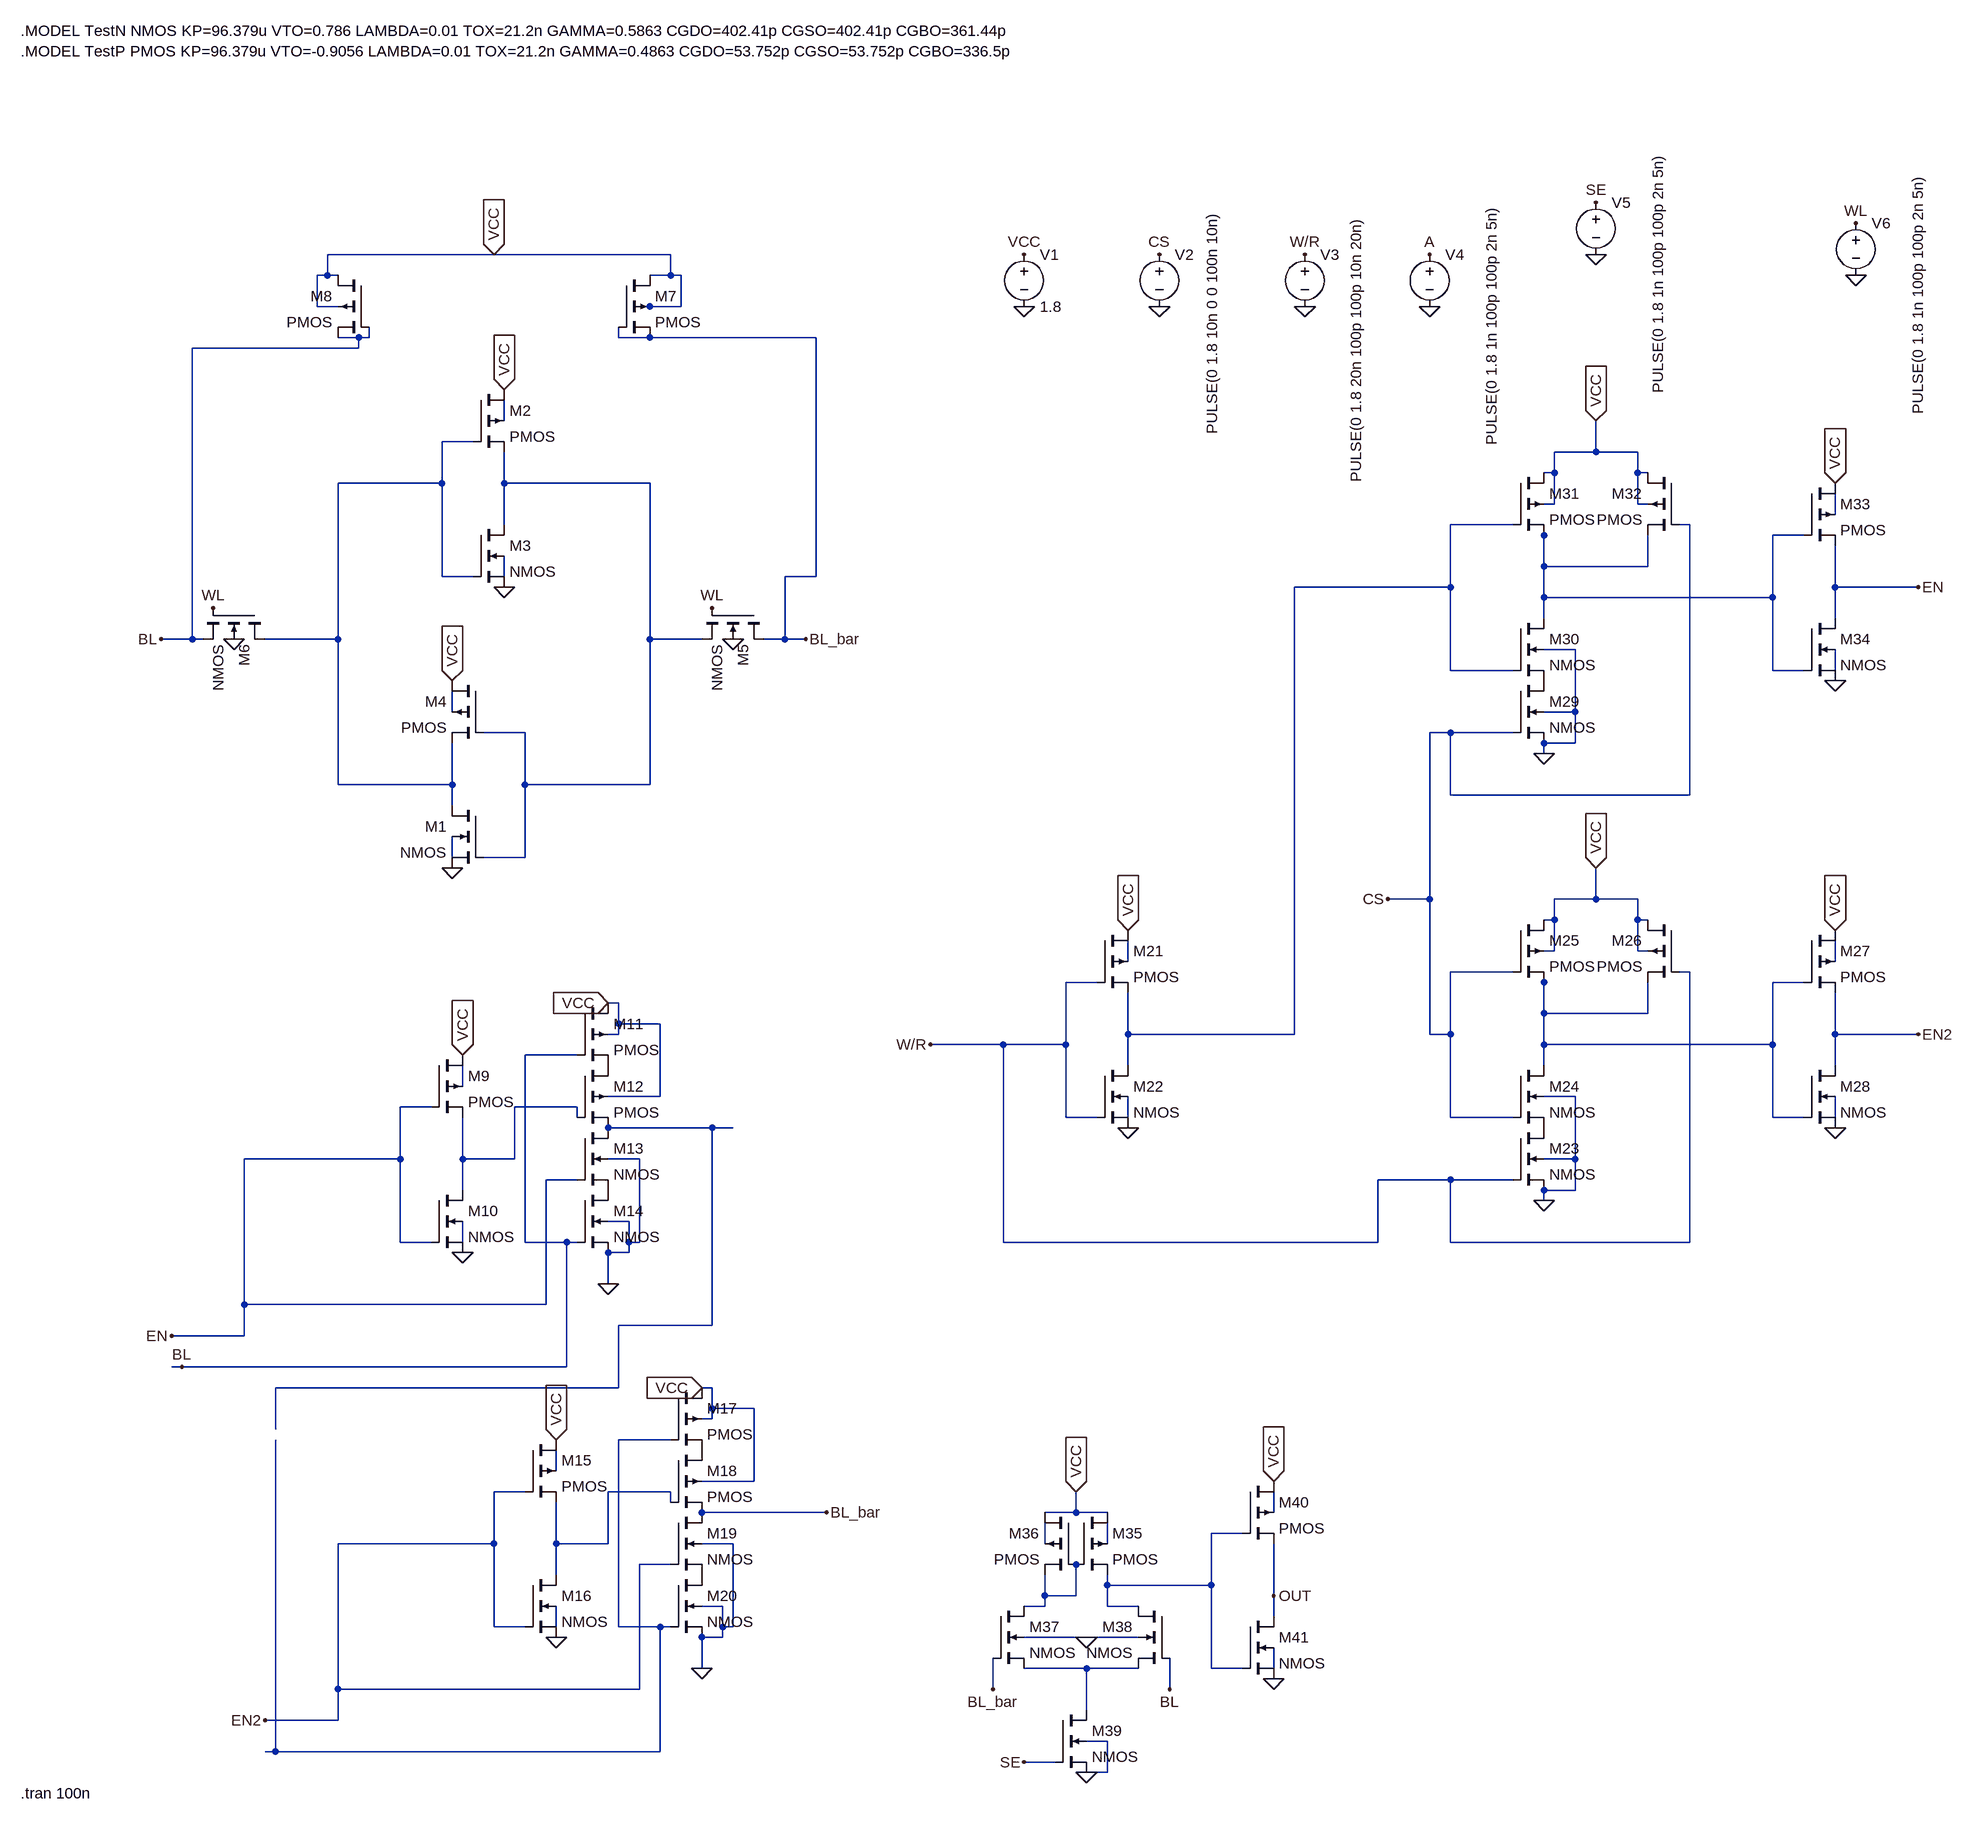
[diagram p0: schematic SirsnoteRAM only ideal.asc]
SirsnoteRAM only ideal.asc, the LTspice schematic file:
Version 4
SHEET 1 2480 2656
WIRE 112 208 -144 208
WIRE 384 208 112 208
WIRE -144 240 -144 208
WIRE -144 240 -160 240
WIRE -128 240 -144 240
WIRE 384 240 384 208
WIRE 384 240 352 240
WIRE 400 240 384 240
WIRE -160 288 -160 240
WIRE -128 288 -160 288
WIRE 352 288 336 288
WIRE 400 288 400 240
WIRE 400 288 352 288
WIRE -96 336 -128 336
WIRE -80 336 -80 320
WIRE -80 336 -96 336
WIRE 304 336 304 320
WIRE 352 336 304 336
WIRE 608 336 352 336
WIRE -96 352 -96 336
WIRE -96 352 -352 352
WIRE 128 464 128 432
WIRE 80 496 32 496
WIRE 1808 512 1808 464
WIRE 1808 512 1744 512
WIRE 1872 512 1808 512
WIRE 1744 544 1744 512
WIRE 1744 544 1728 544
WIRE 1872 544 1872 512
WIRE 1888 544 1872 544
WIRE 32 560 32 496
WIRE 32 560 -128 560
WIRE 128 560 128 512
WIRE 352 560 128 560
WIRE 1744 592 1744 544
WIRE 1744 592 1728 592
WIRE 1872 592 1872 544
WIRE 1888 592 1872 592
WIRE 2176 608 2176 576
WIRE 128 624 128 560
WIRE 1680 624 1584 624
WIRE 1952 624 1936 624
WIRE 1728 640 1728 624
WIRE 2128 640 2080 640
WIRE 1728 688 1728 640
WIRE 1888 688 1888 640
WIRE 1888 688 1728 688
WIRE 32 704 32 560
WIRE 80 704 32 704
WIRE 128 704 128 672
WIRE 608 704 608 336
WIRE 608 704 560 704
WIRE 1584 720 1584 624
WIRE 1584 720 1344 720
WIRE 2176 720 2176 656
WIRE 2304 720 2176 720
WIRE 1728 736 1728 688
WIRE 2080 736 2080 640
WIRE 2080 736 1728 736
WIRE 1728 768 1728 736
WIRE 2176 768 2176 720
WIRE -352 800 -352 352
WIRE -352 800 -400 800
WIRE -336 800 -352 800
WIRE -128 800 -128 560
WIRE -128 800 -240 800
WIRE 352 800 352 560
WIRE 432 800 352 800
WIRE 560 800 560 704
WIRE 560 800 528 800
WIRE 592 800 560 800
WIRE 1776 816 1728 816
WIRE 1584 848 1584 720
WIRE 1680 848 1584 848
WIRE 2080 848 2080 736
WIRE 2128 848 2080 848
WIRE 2176 848 2176 816
WIRE 48 912 48 880
WIRE 1776 912 1776 816
WIRE 1776 912 1728 912
WIRE 160 944 96 944
WIRE 1584 944 1552 944
WIRE 1680 944 1584 944
WIRE 1776 960 1776 912
WIRE 1776 960 1728 960
WIRE 1728 976 1728 960
WIRE -128 1024 -128 800
WIRE 48 1024 48 960
WIRE 48 1024 -128 1024
WIRE 160 1024 160 944
WIRE 352 1024 352 800
WIRE 352 1024 160 1024
WIRE 1584 1040 1584 944
WIRE 1952 1040 1952 624
WIRE 1952 1040 1584 1040
WIRE 48 1056 48 1024
WIRE 48 1136 48 1104
WIRE 160 1136 160 1024
WIRE 160 1136 96 1136
WIRE 1552 1200 1552 944
WIRE 1552 1200 1488 1200
WIRE 1808 1200 1808 1152
WIRE 1808 1200 1744 1200
WIRE 1872 1200 1808 1200
WIRE 1744 1232 1744 1200
WIRE 1744 1232 1728 1232
WIRE 1872 1232 1872 1200
WIRE 1888 1232 1872 1232
WIRE 1744 1280 1744 1232
WIRE 1744 1280 1728 1280
WIRE 1872 1280 1872 1232
WIRE 1888 1280 1872 1280
WIRE 1088 1296 1088 1264
WIRE 2176 1296 2176 1264
WIRE 1680 1312 1584 1312
WIRE 1952 1312 1936 1312
WIRE 1040 1328 992 1328
WIRE 1728 1328 1728 1312
WIRE 2128 1328 2080 1328
WIRE 304 1360 288 1360
WIRE 1728 1376 1728 1328
WIRE 1888 1376 1888 1328
WIRE 1888 1376 1728 1376
WIRE 304 1392 304 1360
WIRE 368 1392 304 1392
WIRE 304 1408 304 1392
WIRE 304 1408 288 1408
WIRE 1088 1408 1088 1344
WIRE 1344 1408 1344 720
WIRE 1344 1408 1088 1408
WIRE 1552 1408 1552 1200
WIRE 1584 1408 1584 1312
WIRE 1584 1408 1552 1408
WIRE 2176 1408 2176 1344
WIRE 2304 1408 2176 1408
WIRE 896 1424 784 1424
WIRE 992 1424 992 1328
WIRE 992 1424 896 1424
WIRE 1728 1424 1728 1376
WIRE 2080 1424 2080 1328
WIRE 2080 1424 1728 1424
WIRE 240 1440 160 1440
WIRE 1088 1456 1088 1408
WIRE 1728 1456 1728 1424
WIRE 2176 1456 2176 1408
WIRE 64 1488 64 1456
WIRE 368 1504 368 1392
WIRE 368 1504 288 1504
WIRE 1776 1504 1728 1504
WIRE 16 1520 -32 1520
WIRE 240 1520 144 1520
WIRE 240 1536 240 1520
WIRE 992 1536 992 1424
WIRE 1040 1536 992 1536
WIRE 1088 1536 1088 1504
WIRE 1584 1536 1584 1408
WIRE 1680 1536 1584 1536
WIRE 2080 1536 2080 1424
WIRE 2128 1536 2080 1536
WIRE 2176 1536 2176 1504
WIRE 448 1552 288 1552
WIRE 480 1552 448 1552
WIRE -32 1600 -32 1520
WIRE -32 1600 -272 1600
WIRE 64 1600 64 1536
WIRE 144 1600 144 1520
WIRE 144 1600 64 1600
WIRE 336 1600 288 1600
WIRE 1776 1600 1776 1504
WIRE 1776 1600 1728 1600
WIRE 240 1632 192 1632
WIRE 1584 1632 1472 1632
WIRE 1680 1632 1584 1632
WIRE 64 1648 64 1600
WIRE 1776 1648 1776 1600
WIRE 1776 1648 1728 1648
WIRE 1728 1664 1728 1648
WIRE 320 1696 288 1696
WIRE -32 1728 -32 1600
WIRE 16 1728 -32 1728
WIRE 64 1728 64 1696
WIRE 160 1728 160 1440
WIRE 224 1728 160 1728
WIRE 240 1728 224 1728
WIRE 320 1728 320 1696
WIRE 336 1728 336 1600
WIRE 336 1728 320 1728
WIRE 896 1728 896 1424
WIRE 1472 1728 1472 1632
WIRE 1472 1728 896 1728
WIRE 1584 1728 1584 1632
WIRE 1952 1728 1952 1312
WIRE 1952 1728 1584 1728
WIRE 320 1744 320 1728
WIRE 320 1744 288 1744
WIRE 288 1792 288 1744
WIRE -272 1824 -272 1600
WIRE 192 1824 192 1632
WIRE 192 1824 -272 1824
WIRE 448 1856 448 1552
WIRE 448 1856 304 1856
WIRE -272 1872 -272 1824
WIRE -272 1872 -384 1872
WIRE -368 1920 -384 1920
WIRE 224 1920 224 1728
WIRE 224 1920 -368 1920
WIRE 304 1952 304 1856
WIRE 304 1952 -224 1952
WIRE 448 1952 432 1952
WIRE 448 1984 448 1952
WIRE 512 1984 448 1984
WIRE 448 2000 448 1984
WIRE 448 2000 432 2000
WIRE -224 2016 -224 1952
WIRE 384 2032 304 2032
WIRE 208 2080 208 2048
WIRE 512 2096 512 1984
WIRE 512 2096 432 2096
WIRE 160 2112 112 2112
WIRE 384 2112 288 2112
WIRE 384 2128 384 2112
WIRE 624 2144 432 2144
WIRE 1008 2144 1008 2112
WIRE 1008 2144 960 2144
WIRE 1056 2144 1008 2144
WIRE 1312 2144 1312 2112
WIRE 1264 2176 1216 2176
WIRE 112 2192 112 2112
WIRE 112 2192 -128 2192
WIRE 208 2192 208 2128
WIRE 288 2192 288 2112
WIRE 288 2192 208 2192
WIRE 480 2192 432 2192
WIRE 960 2192 960 2160
WIRE 1056 2192 1056 2160
WIRE 384 2224 336 2224
WIRE 208 2240 208 2192
WIRE 1056 2256 1056 2240
WIRE 1216 2256 1216 2176
WIRE 1216 2256 1056 2256
WIRE 960 2272 960 2240
WIRE 1008 2272 1008 2224
WIRE 1008 2272 960 2272
WIRE 1312 2272 1312 2192
WIRE 464 2288 432 2288
WIRE 960 2288 960 2272
WIRE 960 2288 928 2288
WIRE 1056 2288 1056 2256
WIRE 1104 2288 1056 2288
WIRE 1312 2304 1312 2272
WIRE 112 2320 112 2192
WIRE 160 2320 112 2320
WIRE 208 2320 208 2288
WIRE 304 2320 304 2032
WIRE 368 2320 304 2320
WIRE 384 2320 368 2320
WIRE 464 2320 464 2288
WIRE 480 2320 480 2192
WIRE 480 2320 464 2320
WIRE 464 2336 464 2320
WIRE 464 2336 432 2336
WIRE 1024 2336 928 2336
WIRE 1104 2336 1024 2336
WIRE 432 2384 432 2336
WIRE 1024 2384 928 2384
WIRE 1104 2384 1024 2384
WIRE 1216 2384 1216 2256
WIRE 1264 2384 1216 2384
WIRE 1312 2384 1312 2352
WIRE -128 2416 -128 2192
WIRE 336 2416 336 2224
WIRE 336 2416 -128 2416
WIRE 880 2416 880 2368
WIRE 1152 2416 1152 2368
WIRE 1024 2448 1024 2384
WIRE -128 2464 -128 2416
WIRE -128 2464 -240 2464
WIRE 1056 2496 1024 2496
WIRE -224 2512 -224 2032
WIRE -224 2512 -240 2512
WIRE 368 2512 368 2320
WIRE 368 2512 -224 2512
WIRE 976 2528 928 2528
WIRE 1056 2544 1056 2496
WIRE 1056 2544 1024 2544
FLAG -400 800 BL
FLAG 592 800 BL_bar
FLAG 448 752 WL
FLAG -320 752 WL
FLAG 48 864 VCC
IOPIN 48 864 In
FLAG 128 416 VCC
IOPIN 128 416 In
FLAG 48 1152 0
FLAG 128 720 0
FLAG 112 208 VCC
IOPIN 112 208 In
FLAG 64 1440 VCC
IOPIN 64 1440 In
FLAG 64 1744 0
FLAG 288 1360 VCC
IOPIN 288 1360 In
FLAG 288 1792 0
FLAG -384 1872 EN
FLAG 208 2032 VCC
IOPIN 208 2032 In
FLAG 208 2336 0
FLAG 432 1952 VCC
IOPIN 432 1952 In
FLAG 432 2384 0
FLAG 624 2144 BL_bar
FLAG -240 2464 EN2
FLAG -368 1920 BL
FLAG 1088 1248 VCC
IOPIN 1088 1248 In
FLAG 1088 1552 0
FLAG 784 1424 W/R
FLAG 2176 1248 VCC
IOPIN 2176 1248 In
FLAG 2176 1552 0
FLAG 1808 1152 VCC
IOPIN 1808 1152 In
FLAG 1728 1664 0
FLAG 2176 560 VCC
IOPIN 2176 560 In
FLAG 2176 864 0
FLAG 1808 464 VCC
IOPIN 1808 464 In
FLAG 1728 976 0
FLAG 1488 1200 CS
FLAG 2304 1408 EN2
FLAG 2304 720 EN
FLAG 928 288 0
FLAG 1136 288 0
FLAG 1360 288 0
FLAG 1552 288 0
FLAG 928 208 VCC
FLAG 1552 208 A
FLAG 1136 208 CS
FLAG 1360 208 W/R
FLAG -288 800 0
FLAG 480 800 0
FLAG 1008 2112 VCC
IOPIN 1008 2112 In
FLAG 1024 2544 0
FLAG 1024 2336 0
FLAG 1152 2416 BL
FLAG 880 2416 BL_bar
FLAG 928 2528 SE
FLAG 1312 2096 VCC
IOPIN 1312 2096 In
FLAG 1312 2400 0
FLAG 1312 2272 OUT
FLAG 1808 208 0
FLAG 1808 128 SE
FLAG 2208 240 0
FLAG 2208 160 WL
SYMBOL nmos4 96 1056 M0
SYMATTR InstName M1
SYMBOL pmos4 80 416 R0
SYMATTR InstName M2
SYMBOL nmos4 80 624 R0
SYMATTR InstName M3
SYMBOL pmos4 96 864 M0
SYMATTR InstName M4
SYMBOL nmos4 528 752 R90
SYMATTR InstName M5
SYMBOL nmos4 -240 752 R90
SYMATTR InstName M6
SYMBOL pmos4 304 240 R0
SYMATTR InstName M7
SYMBOL pmos4 -80 240 M0
SYMATTR InstName M8
SYMBOL pmos4 16 1440 R0
SYMATTR InstName M9
SYMBOL nmos4 16 1648 R0
SYMATTR InstName M10
SYMBOL pmos4 240 1360 R0
SYMATTR InstName M11
SYMBOL pmos4 240 1456 R0
SYMATTR InstName M12
SYMBOL nmos4 240 1552 R0
SYMATTR InstName M13
SYMBOL nmos4 240 1648 R0
SYMATTR InstName M14
SYMBOL pmos4 160 2032 R0
SYMATTR InstName M15
SYMBOL nmos4 160 2240 R0
SYMATTR InstName M16
SYMBOL pmos4 384 1952 R0
SYMATTR InstName M17
SYMBOL pmos4 384 2048 R0
SYMATTR InstName M18
SYMBOL nmos4 384 2144 R0
SYMATTR InstName M19
SYMBOL nmos4 384 2240 R0
SYMATTR InstName M20
SYMBOL pmos4 1040 1248 R0
SYMATTR InstName M21
SYMBOL nmos4 1040 1456 R0
SYMATTR InstName M22
SYMBOL nmos4 1680 1552 R0
SYMATTR InstName M23
SYMBOL nmos4 1680 1456 R0
SYMATTR InstName M24
SYMBOL pmos4 1680 1232 R0
SYMATTR InstName M25
SYMBOL pmos4 1936 1232 M0
SYMATTR InstName M26
SYMBOL pmos4 2128 1248 R0
SYMATTR InstName M27
SYMBOL nmos4 2128 1456 R0
SYMATTR InstName M28
SYMBOL nmos4 1680 864 R0
SYMATTR InstName M29
SYMBOL nmos4 1680 768 R0
SYMATTR InstName M30
SYMBOL pmos4 1680 544 R0
SYMATTR InstName M31
SYMBOL pmos4 1936 544 M0
SYMATTR InstName M32
SYMBOL pmos4 2128 560 R0
SYMATTR InstName M33
SYMBOL nmos4 2128 768 R0
SYMATTR InstName M34
SYMBOL voltage 928 192 R0
WINDOW 123 0 0 Left 0
WINDOW 39 0 0 Left 0
SYMATTR InstName V1
SYMATTR Value 1.8
SYMBOL voltage 1136 192 R0
WINDOW 3 81 -51 VRight 2
WINDOW 123 0 0 Left 0
WINDOW 39 0 0 Left 0
SYMATTR Value PULSE(0 1.8 10n 0 0 100n 10n)
SYMATTR InstName V2
SYMBOL voltage 1360 192 R0
WINDOW 3 79 -45 VRight 2
WINDOW 123 0 0 Left 0
WINDOW 39 0 0 Left 0
SYMATTR Value PULSE(0 1.8 20n 100p 100p 10n 20n)
SYMATTR InstName V3
SYMBOL voltage 1552 192 R0
WINDOW 3 95 -61 VRight 2
WINDOW 123 0 0 Left 0
WINDOW 39 0 0 Left 0
SYMATTR Value PULSE(0 1.8 1n 100p 100p 2n 5n)
SYMATTR InstName V4
SYMBOL pmos4 1008 2144 R0
SYMATTR InstName M35
SYMBOL pmos4 1008 2144 M0
SYMATTR InstName M36
SYMBOL nmos4 880 2288 R0
SYMATTR InstName M37
SYMBOL nmos4 1152 2288 M0
SYMATTR InstName M38
SYMBOL nmos4 976 2448 R0
SYMATTR InstName M39
SYMBOL pmos4 1264 2096 R0
SYMATTR InstName M40
SYMBOL nmos4 1264 2304 R0
SYMATTR InstName M41
SYMBOL voltage 1808 112 R0
WINDOW 3 95 -61 VRight 2
WINDOW 123 0 0 Left 0
WINDOW 39 0 0 Left 0
SYMATTR Value PULSE(0 1.8 1n 100p 100p 2n 5n)
SYMATTR InstName V5
SYMBOL voltage 2208 144 R0
WINDOW 3 95 -61 VRight 2
WINDOW 123 0 0 Left 0
WINDOW 39 0 0 Left 0
SYMATTR Value PULSE(0 1.8 1n 100p 100p 2n 5n)
SYMATTR InstName V6
TEXT -616 -136 Left 2 !.MODEL TestN NMOS KP=96.379u VTO=0.786 LAMBDA=0.01 TOX=21.2n GAMMA=0.5863 CGDO=402.41p CGSO=402.41p CGBO=361.44p\n.MODEL TestP PMOS KP=96.379u VTO=-0.9056 LAMBDA=0.01 TOX=21.2n GAMMA=0.4863 CGDO=53.752p CGSO=53.752p CGBO=336.5p
TEXT -616 2576 Left 2 !.tran 100n

The netlist it stands for:
* SirsnoteRAM only ideal.asc
M1 N002 N003 0 N010 NMOS
M2 VCC N002 N003 N001 PMOS
M3 N003 N002 0 N007 NMOS
M4 VCC N003 N002 N009 PMOS
M5 BL_bar WL N003 0 NMOS
M6 N002 WL BL 0 NMOS
M7 VCC BL_bar BL_bar VCC PMOS
M8 VCC BL BL VCC PMOS
M9 VCC EN N015 N014 PMOS
M10 N015 EN 0 N019 NMOS
M11 VCC BL P001 VCC PMOS
M12 P001 N015 N018 VCC PMOS
M13 N018 EN P002 0 NMOS
M14 P002 BL 0 0 NMOS
M15 VCC EN2 N022 N021 PMOS
M16 N022 EN2 0 N028 NMOS
M17 VCC N020 P003 VCC PMOS
M18 P003 N022 BL_bar VCC PMOS
M19 BL_bar EN2 P004 0 NMOS
M20 P004 N020 0 0 NMOS
M21 VCC W/R N005 N011 PMOS
M22 N005 W/R 0 N016 NMOS
M23 P005 W/R 0 0 NMOS
M24 N013 CS P005 0 NMOS
M25 VCC CS N013 VCC PMOS
M26 VCC W/R N013 VCC PMOS
M27 VCC N013 EN2 N012 PMOS
M28 EN2 N013 0 N017 NMOS
M29 P006 CS 0 0 NMOS
M30 N006 N005 P006 0 NMOS
M31 VCC N005 N006 VCC PMOS
M32 VCC CS N006 VCC PMOS
M33 VCC N006 EN N004 PMOS
M34 EN N006 0 N008 NMOS
V1 VCC 0 1.8
V2 CS 0 PULSE(0 1.8 10n 0 0 100n 10n)
V3 W/R 0 PULSE(0 1.8 20n 100p 100p 10n 20n)
V4 A 0 PULSE(0 1.8 1n 100p 100p 2n 5n)
M35 VCC N027 N024 N026 PMOS
M36 VCC N027 N027 N025 PMOS
M37 N027 BL_bar N029 0 NMOS
M38 N024 BL N029 0 NMOS
M39 N029 SE 0 0 NMOS
M40 VCC N024 OUT N023 PMOS
M41 OUT N024 0 N030 NMOS
V5 SE 0 PULSE(0 1.8 1n 100p 100p 2n 5n)
V6 WL 0 PULSE(0 1.8 1n 100p 100p 2n 5n)
.model NMOS NMOS
.model PMOS PMOS
.lib standard.mos
.MODEL TestN NMOS KP=96.379u VTO=0.786 LAMBDA=0.01 TOX=21.2n GAMMA=0.5863 CGDO=402.41p CGSO=402.41p CGBO=361.44p
.MODEL TestP PMOS KP=96.379u VTO=-0.9056 LAMBDA=0.01 TOX=21.2n GAMMA=0.4863 CGDO=53.752p CGSO=53.752p CGBO=336.5p
.tran 100n
.backanno
.end

* Results of the author's LTspice run, read from the files saved beside the schematic
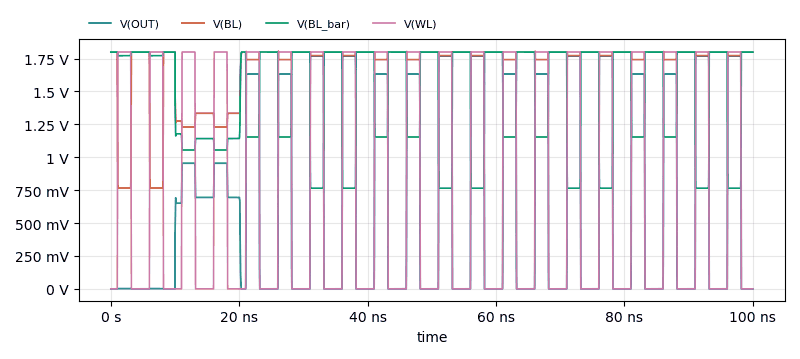
[diagram p1: Transient Analysis of SirsnoteRAM only ideal.asc, plotted from the saved traces]
* Transient Analysis, 1 run:
*   V(OUT): min 0 V, max 1.77 V, average 654.3 mV, rms 1.018 V, last 511.2 nV
*   V(BL): min 765.2 mV, max 1.806 V, average 1.69 V, rms 1.708 V, last 1.8 V
*   V(BL_bar): min 765.2 mV, max 1.801 V, average 1.445 V, rms 1.502 V, last 1.799 V
*   V(WL): min 0 V, max 1.8 V, average 756 mV, rms 1.158 V, last 0 V